# EAGLE design msp430_qfn16 (EAGLE 7.5.0)
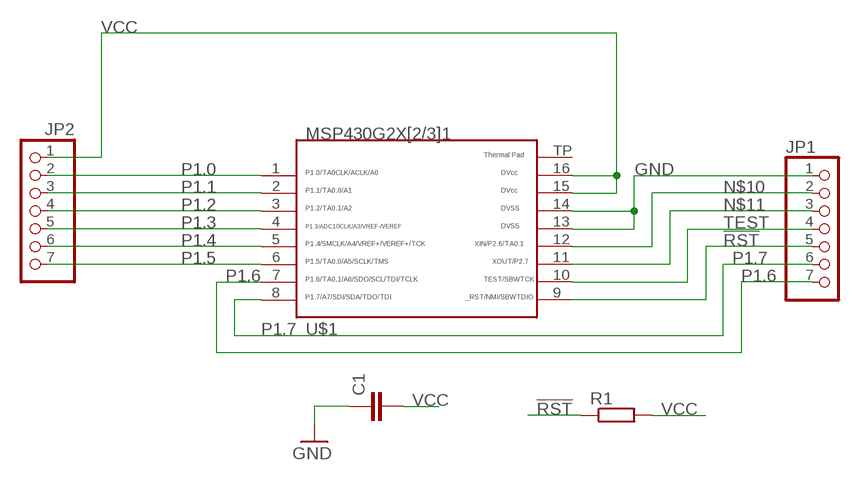
[diagram p0: schematic, sheet 1]

## Parts
C1  C-EUC0805K  [C0805K]
JP1  PINHD-1X7  [1X07]
JP2  PINHD-1X7  [1X07]
R1  R-EU_R0805  [R0805]
U$1  G2X[2/3]1---RSA16  [RSA16]

## Nets
!RST: JP1.5 R1.1 U$1.9
GND: C1.1 JP1.1 U$1.13 U$1.14
N$10: JP1.2 U$1.12
N$11: JP1.3 U$1.11
P1.0: JP2.2 U$1.1
P1.1: JP2.3 U$1.2
P1.2: JP2.4 U$1.3
P1.3: JP2.5 U$1.4
P1.4: JP2.6 U$1.5
P1.5: JP2.7 U$1.6
P1.6: JP1.7 U$1.7
P1.7: JP1.6 U$1.8
TEST: JP1.4 U$1.10
VCC [GND]: C1.2 JP2.1 R1.2 U$1.15 U$1.16
Unconnected: U$1.TP

## Library data of the parts
C1 = resistor:C-EU: CAPACITOR, European symbol
JP1 JP2 = pinhead:PINHD-1X7: PIN HEADER
R1 = resistor:R-EU_: RESISTOR, European symbol
U$1 = TI_MSP430_v16:G2X[2/3]1---RSA16: MSP430G2X[2/3]1 QFN (RSA) 16 Pin Package http://focus.ti.com/docs/prod/folders/print/msp430g2221.html

## Net classes
0 default: width 0.305 mm, drill 0.508 mm, clearance 0.178 mm
1 GND: width 0.508 mm, drill 0.508 mm, clearance 0.178 mm
2 VCC: width 1.016 mm, drill 0.508 mm, clearance 0.178 mm

## Board
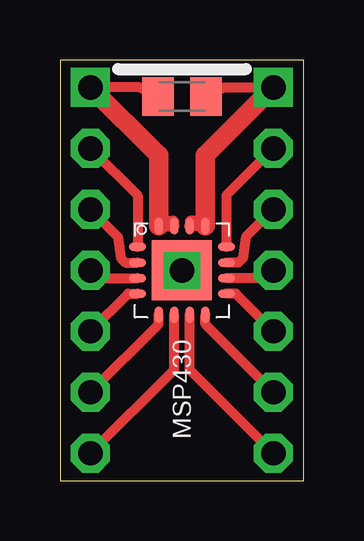
[diagram p1: board, top side]
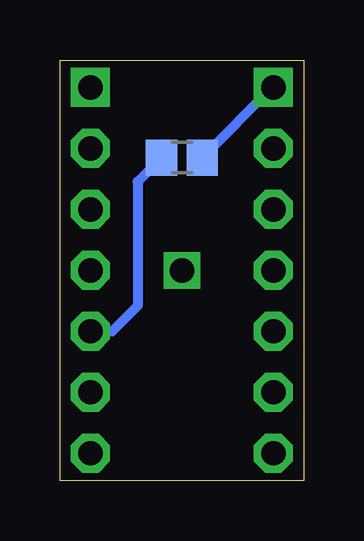
[diagram p2: board, bottom side, seen from below]

Size 10.16 x 17.53 mm. Coordinates in mm from the lower left corner, seen from the top.
Outline: 0,0 10.16,0 10.16,17.53 0,17.53 0,0
Copper layers (1*16): Top 0.035mm / dielectric 1.5mm / Bottom 0.035mm
Design rules "SparkFun *": minimum track width 8mil, minimum drill 20mil, track to track 6mil, track to pad 6mil, pad to pad 6mil, via to via 6mil, smd to smd 6mil, copper to edge 8mil, drill to drill 8mil, minimum pad ring 12mil, minimum via ring 10mil, stop-mask expansion 4mil, vias tented up to drill 25mil, thermal gap 10mil

### Footprints (pad centres in the part's own frame; a part is rotated, then mirrored left to right if it is on the bottom)
C0805K = smd 1.3 x 1.6: 1 -1,0; 2 1,0
1X07 = drill 1.016 square: 1 -7.62,0 | drill 1.016 octagon: 2 -5.08,0; 3 -2.54,0; 4 0,0; 5 2.54,0; 6 5.08,0; 7 7.62,0
R0805 = smd 1.3 x 1.5: 1 -0.85,0; 2 0.85,0
RSA16 = smd 0.7 x 0.35: 1 -1.85,0.975; 2 -1.85,0.325; 3 -1.85,-0.325; 4 -1.85,-0.975; 9 1.85,-0.975; 10 1.85,-0.325; 11 1.85,0.325; 12 1.85,0.975 | smd 0.35 x 0.7: 5 -0.975,-1.85; 6 -0.325,-1.85; 7 0.325,-1.85; 8 0.975,-1.85; 13 0.975,1.85; 14 0.325,1.85; 15 -0.325,1.85; 16 -0.975,1.85 | smd 2.5 x 2.5: TP 0,0

### Placement (x,y rotation side)
C1  5.08,16 180 top
JP1  8.89,8.76 270 top
JP2  1.27,8.76 270 top
R1  5.08,13.46 0 bottom
U$1  5.08,8.76 0 top

### Tracks (layer width: path | path; a pad name or v marks a point on that pad's centre or on a via)
!RST
  Top 0.406: JP1.5 7.33,7.79 U$1.9
  Bottom 0.406: R1.1 6.93,12.46 6.93,7.28 7.99,6.22 JP1.5
GND
  Top 0.406: C1.1 6.84,16.38 JP1.1
  Top 0.457: U$1.13 U$1.14
  Top 0.508: 5.46,10.79 6.1,10.79 6.1,10.65 U$1.13
  Top 0.813: JP1.1 6.06,13.55 U$1.13
N$10
  Top 0.406: JP1.2 6.93,11.88 U$1.12
N$11
  Top 0.406: JP1.3 7.75,10.16 7.62,9.27 7.44,9.09 U$1.11
P1.0
  Top 0.406: JP2.2 3.23,11.88 U$1.1
P1.1
  Top 0.406: JP2.3 2.41,10.16 2.54,9.27 2.72,9.09 U$1.2
P1.2
  Top 0.406: JP2.4 1.59,8.44 U$1.3
P1.3
  Top 0.406: JP2.5 2.83,7.79 U$1.4
P1.4
  Top 0.406: JP2.6 4.11,6.52 U$1.5
P1.5
  Top 0.406: JP2.7 4.75,4.63 U$1.6
P1.6
  Top 0.406: JP1.7 5.41,4.63 U$1.7
P1.7
  Top 0.406: JP1.6 6.06,6.52 U$1.8
TEST
  Top 0.406: JP1.4 8.57,8.44 U$1.10
TP  (via drill 1.02)
  other vias: 5.08,8.76
VCC
  Top 0.406: C1.2 3.32,16.38 JP2.1
  Top 0.457: U$1.16 U$1.15
  Top 0.508: 4.7,10.79 4.06,10.79 4.06,10.65 U$1.16
  Top 0.813: JP2.1 4.11,13.55 U$1.16
  Bottom 0.406: R1.2 1.31,16.38 JP2.1

### Text on the board
tNames: MSP430